# EAGLE design E-Book Wing Rev B (EAGLE 9.4.2)
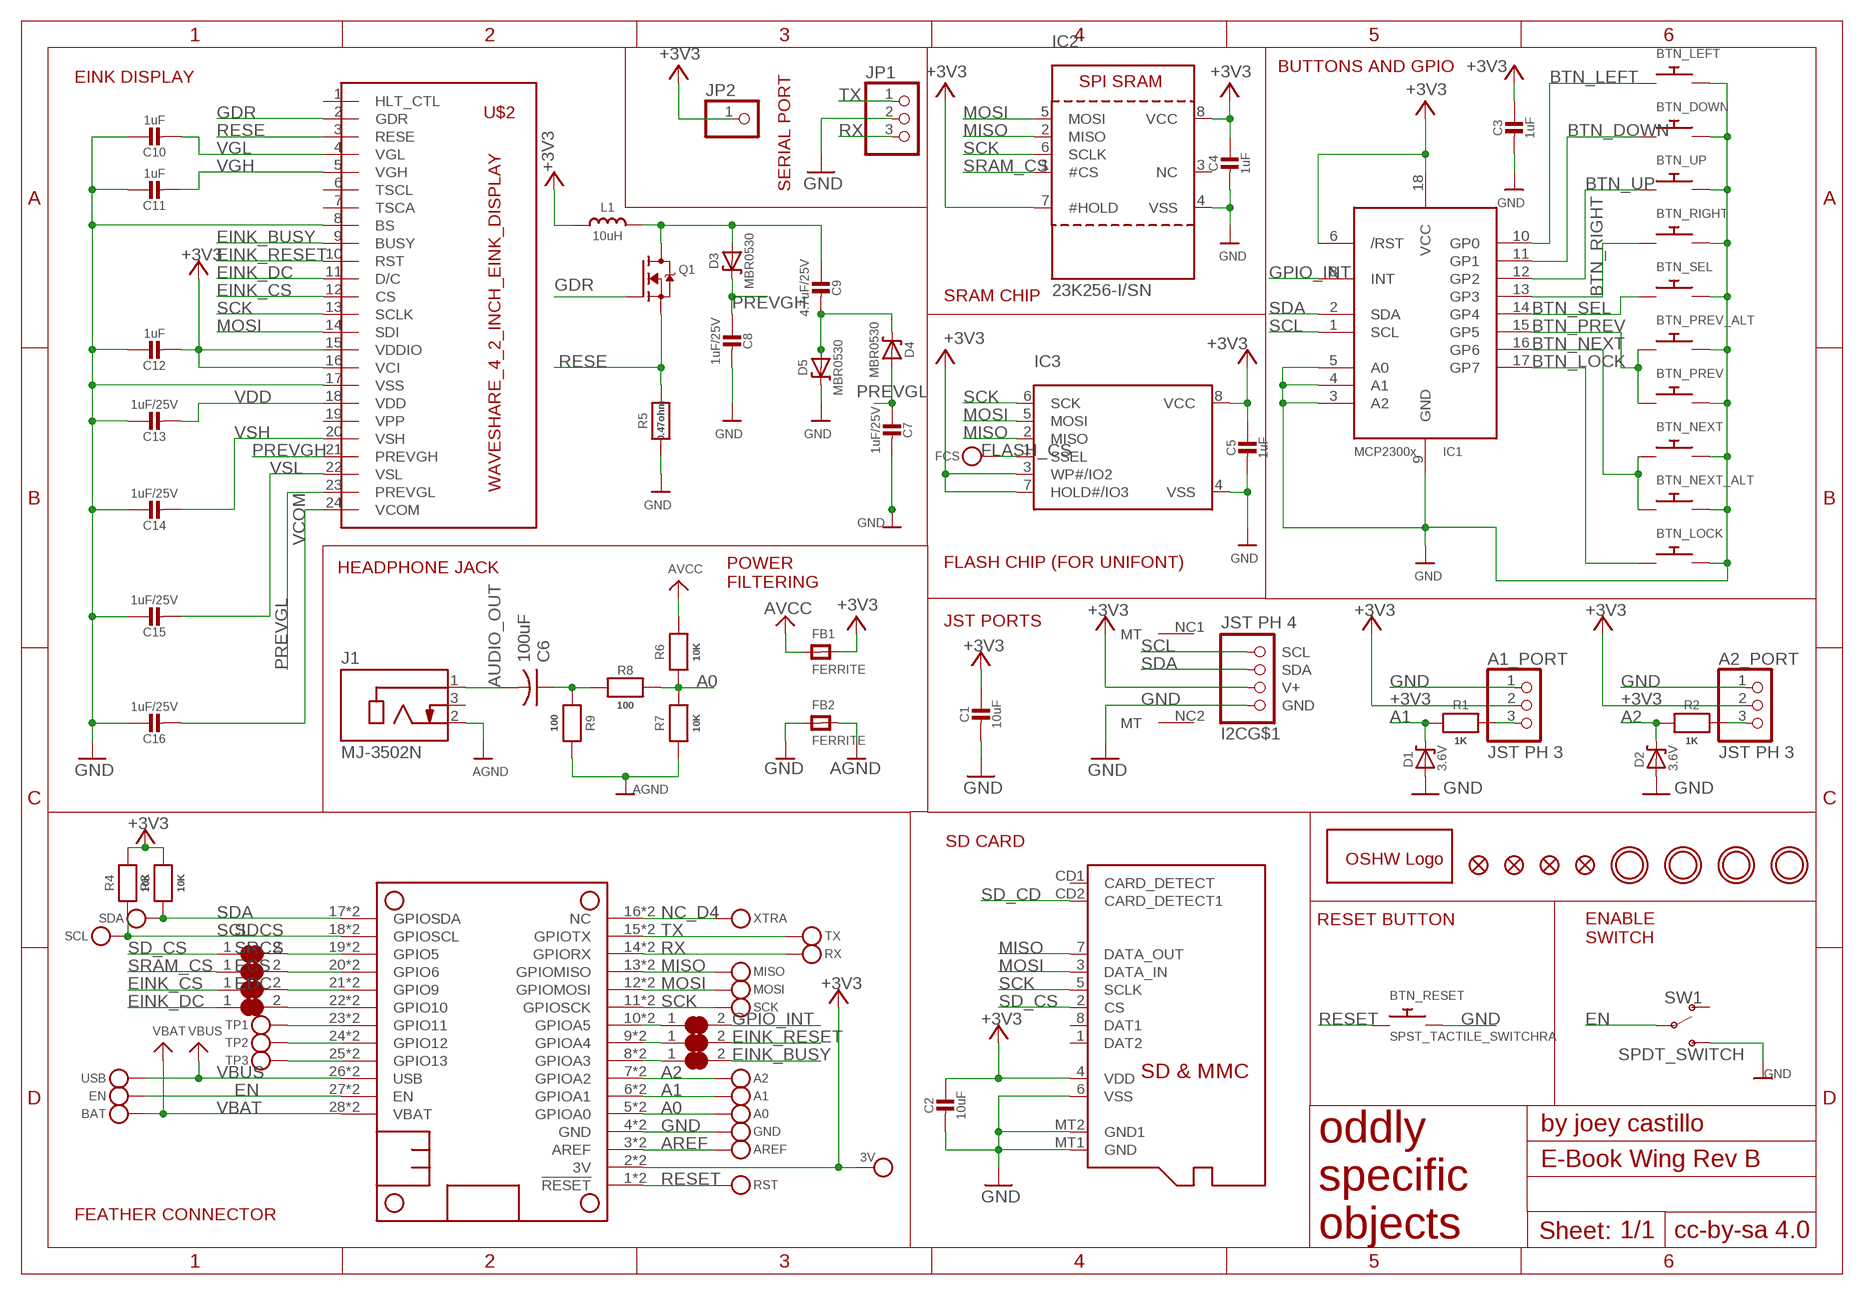
[diagram p0: schematic, sheet 1]

## Parts
3V  MICROBUILDER_TESTPOINT1.5X2.0MM_NOCREAM  [MICROBUILDER_PAD-1.5X2.0]
A0  MICROBUILDER_TESTPOINT1.5X2.0MM_NOCREAM  [MICROBUILDER_PAD-1.5X2.0]
A1  MICROBUILDER_TESTPOINT1.5X2.0MM_NOCREAM  [MICROBUILDER_PAD-1.5X2.0]
A1_PORT  JST PH 3  CON_JST_PH_3PIN  [JSTPH3]
A2  MICROBUILDER_TESTPOINT1.5X2.0MM_NOCREAM  [MICROBUILDER_PAD-1.5X2.0]
A2_PORT  JST PH 3  CON_JST_PH_3PIN  [JSTPH3]
AREF  MICROBUILDER_TESTPOINT1.5X2.0MM_NOCREAM  [MICROBUILDER_PAD-1.5X2.0]
BAT  MICROBUILDER_TESTPOINT1.5X2.0MM_NOCREAM  [MICROBUILDER_PAD-1.5X2.0]
BTN_DOWN  MJTP1250_SPST_SWITCH  [MJTP1250]
BTN_LEFT  MJTP1250_SPST_SWITCH  [MJTP1250]
BTN_LOCK  SPST_TACTILE_SWITCHRA  [TL3330AF130QG]
BTN_NEXT  MJTP1250_SPST_SWITCH  [MJTP1250]
BTN_NEXT_ALT  SPST_TACTILE_SWITCHRA  [TL3330AF130QG]
BTN_PREV  MJTP1250_SPST_SWITCH  [MJTP1250]
BTN_PREV_ALT  SPST_TACTILE_SWITCHRA  [TL3330AF130QG]
BTN_RESET  SPST_TACTILE_SWITCHRA  [TL3330AF130QG]
BTN_RIGHT  MJTP1250_SPST_SWITCH  [MJTP1250]
BTN_SEL  MJTP1250_SPST_SWITCH  [MJTP1250]
BTN_UP  MJTP1250_SPST_SWITCH  [MJTP1250]
C1  10uF  CAP_CERAMIC0805-NOOUTLINE  [0805-NO]
C2  10uF  CAP_CERAMIC0805_10MGAP  [0805_10MGAP]
C3  1uF  CAP_CERAMIC0805_10MGAP  [0805_10MGAP]
C4  1uF  CAP_CERAMIC0805_10MGAP  [0805_10MGAP]
C5  1uF  CAP_CERAMIC0805_10MGAP  [0805_10MGAP]
C6  100uF  C-USC1210  [C1210]
C7  1uF/25V  CAP_CERAMIC0805-NOOUTLINE  [0805-NO]
C8  1uF/25V  CAP_CERAMIC0805-NOOUTLINE  [0805-NO]
C9  4.7uF/25V  CAP_CERAMIC0805-NOOUTLINE  [0805-NO]
C10  1uF  CAP_CERAMIC0805-NOOUTLINE  [0805-NO]
C11  1uF  CAP_CERAMIC0805-NOOUTLINE  [0805-NO]
C12  1uF  CAP_CERAMIC0805-NOOUTLINE  [0805-NO]
C13  1uF/25V  CAP_CERAMIC0805-NOOUTLINE  [0805-NO]
C14  1uF/25V  CAP_CERAMIC0805-NOOUTLINE  [0805-NO]
C15  1uF/25V  CAP_CERAMIC0805-NOOUTLINE  [0805-NO]
C16  1uF/25V  CAP_CERAMIC0805-NOOUTLINE  [0805-NO]
D1  3.6V  DIODE-ZENERSOD123  [SOD-123]
D2  3.6V  DIODE-ZENERSOD123  [SOD-123]
D3  MBR0530  DIODE-SCHOTTKYSOD-123  [SOD-123]
D4  MBR0530  DIODE-SCHOTTKYSOD-123  [SOD-123]
D5  MBR0530  DIODE-SCHOTTKYSOD-123  [SOD-123]
EBSY  MICROBUILDER_SOLDERJUMPER_CLOSED  [MICROBUILDER_SOLDERJUMPER_CLOSEDWIRE]
ECS  MICROBUILDER_SOLDERJUMPER_CLOSED  [MICROBUILDER_SOLDERJUMPER_CLOSEDWIRE]
EDC  MICROBUILDER_SOLDERJUMPER_CLOSED  [MICROBUILDER_SOLDERJUMPER_CLOSEDWIRE]
EN  MICROBUILDER_TESTPOINT1.5X2.0MM_NOCREAM  [MICROBUILDER_PAD-1.5X2.0]
ERST  MICROBUILDER_SOLDERJUMPER_CLOSED  [MICROBUILDER_SOLDERJUMPER_CLOSEDWIRE]
FB1  FERRITE  FERRITE0805  [0805]
FB2  FERRITE  FERRITE0805  [0805]
FCS  MICROBUILDER_TESTPOINTPAD1MM  [MICROBUILDER_TESTPOINT_PAD_1MM]
FID1  FIDUCIAL_1MM  [FIDUCIAL_1MM]
FID2  FIDUCIAL_1MM  [FIDUCIAL_1MM]
FID3  FIDUCIAL_1MM  [FIDUCIAL_1MM]
FID4  FIDUCIAL_1MM  [FIDUCIAL_1MM]
GND  MICROBUILDER_TESTPOINT1.5X2.0MM_NOCREAM  [MICROBUILDER_PAD-1.5X2.0]
GOLD_ORB_SM1  OSHWLOGOLOGO5MM  [OSHW_5MM]
I2C  JST PH 4  STEMMA_I2C_RASMT  [JSTPH4]
IC1  MCP23008/SO  [SO18W]
IC2  23K256-I/SN  SRAM_SPI_SOIC8  [SOIC8_150MIL]
IC3  MICROBUILDER_SPIFLASH_SOIC8  [MICROBUILDER_SOIC8_150MIL]
INT  MICROBUILDER_SOLDERJUMPER_CLOSED  [MICROBUILDER_SOLDERJUMPER_CLOSEDWIRE]
J1  MJ-3502N  [CUI_MJ-3502N]
JP1  PINHD-1X3  [1X03]
JP2  PINHD-1X1  [1X01]
L1  10uH  INDUCTORNR401  [INDUCTOR_4X4MM_NR401]
MICROSD  MICROSD  [MICROSD]
MISO  MICROBUILDER_TESTPOINT1.5X2.0MM_NOCREAM  [MICROBUILDER_PAD-1.5X2.0]
MOSI  MICROBUILDER_TESTPOINT1.5X2.0MM_NOCREAM  [MICROBUILDER_PAD-1.5X2.0]
MS1  MICROBUILDER_FEATHERWING_SMTDUAL  [MICROBUILDER_FEATHERWING_SMT2]
Q1  IRLML0100  IRLML2060TRPBF  [SOT23-3]
R1  1K  RESISTOR_0805MP  [_0805MP]
R2  1K  RESISTOR_0805MP  [_0805MP]
R3  10K  RESISTOR_0805MP  [_0805MP]
R4  10K  RESISTOR_0805MP  [_0805MP]
R5  0.47ohm  RESISTOR0805_10MGAP  [0805_10MGAP]
R6  10K  RESISTOR_0805MP  [_0805MP]
R7  10K  RESISTOR_0805MP  [_0805MP]
R8  100  RESISTOR_0805MP  [_0805MP]
R9  100  RESISTOR_0805MP  [_0805MP]
RST  MICROBUILDER_TESTPOINT1.5X2.0MM_NOCREAM  [MICROBUILDER_PAD-1.5X2.0]
RX  MICROBUILDER_TESTPOINT1.5X2.0MM_NOCREAM  [MICROBUILDER_PAD-1.5X2.0]
SCK  MICROBUILDER_TESTPOINT1.5X2.0MM_NOCREAM  [MICROBUILDER_PAD-1.5X2.0]
SCL  MICROBUILDER_TESTPOINT1.5X2.0MM_NOCREAM  [MICROBUILDER_PAD-1.5X2.0]
SDA  MICROBUILDER_TESTPOINT1.5X2.0MM_NOCREAM  [MICROBUILDER_PAD-1.5X2.0]
SDCS  MICROBUILDER_SOLDERJUMPER_CLOSED  [MICROBUILDER_SOLDERJUMPER_CLOSEDWIRE]
SRCS  MICROBUILDER_SOLDERJUMPER_CLOSED  [MICROBUILDER_SOLDERJUMPER_CLOSEDWIRE]
SW1  SPDT_SWITCH  [A10767]
TP1  MICROBUILDER_TESTPOINT1.5X2.0MM_NOCREAM  [MICROBUILDER_PAD-1.5X2.0]
TP2  MICROBUILDER_TESTPOINT1.5X2.0MM_NOCREAM  [MICROBUILDER_PAD-1.5X2.0]
TP3  MICROBUILDER_TESTPOINT1.5X2.0MM_NOCREAM  [MICROBUILDER_PAD-1.5X2.0]
TX  MICROBUILDER_TESTPOINT1.5X2.0MM_NOCREAM  [MICROBUILDER_PAD-1.5X2.0]
U$1  MOUNTINGHOLE2.5  [MOUNTINGHOLE_2.5_PLATED]
U$2  WAVESHARE_4_2_INCH_EINK_DISPLAY  [EINK_DISPLAY_4_2IN]
U$4  MOUNTINGHOLE2.5  [MOUNTINGHOLE_2.5_PLATED]
U$5  MOUNTINGHOLE2.5  [MOUNTINGHOLE_2.5_PLATED]
U$7  MOUNTINGHOLE2.5  [MOUNTINGHOLE_2.5_PLATED]
USB  MICROBUILDER_TESTPOINT1.5X2.0MM_NOCREAM  [MICROBUILDER_PAD-1.5X2.0]
XTRA  MICROBUILDER_TESTPOINT1.5X2.0MM_NOCREAM  [MICROBUILDER_PAD-1.5X2.0]

## Nets
+3V3: 3V.P$1 A1_PORT.2 A2_PORT.2 C1.1 C2.1 C3.1 C4.1 C5.1 C12.2 FB1.2 I2C.2(V+) IC1.6(/RST) IC1.18(VCC) IC2.7(#HOLD) IC2.8(VCC) IC3.3(WP#/IO2) IC3.7(HOLD#/IO3) IC3.8(VCC) JP2.1 L1.P$2 MICROSD.4(VDD) MS1.2'(3V) MS1.2(3V) R3.1 R4.1 U$2.15(VDDIO) U$2.16(VCI)
_EINK_BUSY: EBSY.1 MS1.8'(GPIOA3) MS1.8(GPIOA3)
_EINK_CS: ECS.2 MS1.21'(GPIO9) MS1.21(GPIO9)
_EINK_DC: EDC.2 MS1.22'(GPIO10) MS1.22(GPIO10)
_EINK_RESET: ERST.1 MS1.9'(GPIOA4) MS1.9(GPIOA4)
_GPIO_INT: INT.1 MS1.10'(GPIOA5) MS1.10(GPIOA5)
_SD_CS: MS1.19'(GPIO5) MS1.19(GPIO5) SDCS.2
_SRAM_CS: MS1.20'(GPIO6) MS1.20(GPIO6) SRCS.2
A0: A0.P$1 MS1.5'(GPIOA0) MS1.5(GPIOA0) R6.2 R7.1 R8.1
A1: A1.P$1 D1.C MS1.6'(GPIOA1) MS1.6(GPIOA1) R1.2
A1_: A1_PORT.3 R1.1
A2: A2.P$1 D2.C MS1.7'(GPIOA2) MS1.7(GPIOA2) R2.2
A2_: A2_PORT.3 R2.1
AGND: FB2.2 J1.2 R7.2 R9.1
AREF: AREF.P$1 MS1.3'(AREF) MS1.3(AREF)
AUDIO_OUT: C6.2 J1.1
AVCC: FB1.1 R6.1
BTN_DOWN: BTN_DOWN.P$1 IC1.11(GP1)
BTN_LEFT: BTN_LEFT.P$1 IC1.10(GP0)
BTN_LOCK: BTN_LOCK.P$1 IC1.17(GP7)
BTN_NEXT: BTN_NEXT.P$1 BTN_NEXT_ALT.P$1 IC1.16(GP6)
BTN_PREV: BTN_PREV.P$1 BTN_PREV_ALT.P$1 IC1.15(GP5)
BTN_RIGHT: BTN_RIGHT.P$1 IC1.13(GP3)
BTN_SEL: BTN_SEL.P$1 IC1.14(GP4)
BTN_UP: BTN_UP.P$1 IC1.12(GP2)
EINK_BUSY: EBSY.2 U$2.9(BUSY)
EINK_CS: ECS.1 U$2.12(CS)
EINK_DC: EDC.1 U$2.11(D/C)
EINK_RESET: ERST.2 U$2.10(RST)
EN: EN.P$1 MS1.27'(EN) MS1.27(EN) SW1.P$2(P)
FLASH_CS: FCS.P$1 IC3.1(SSEL)
GDR: Q1.1(G) U$2.2(GDR)
GND: A1_PORT.1 A2_PORT.1 BTN_DOWN.P$2 BTN_LEFT.P$2 BTN_LOCK.P$2 BTN_NEXT.P$2 BTN_NEXT_ALT.P$2 BTN_PREV.P$2 BTN_PREV_ALT.P$2 BTN_RESET.P$2 BTN_RIGHT.P$2 BTN_SEL.P$2 BTN_UP.P$2 C1.2 C2.2 C3.2 C4.2 C5.2 C7.2 C8.2 C10.1 C11.1 C12.1 C13.1 C14.1 C15.1 C16.1 D1.A D2.A D5.C FB2.1 GND.P$1 I2C.1(GND) IC1.3(A2) IC1.4(A1) IC1.5(A0) IC1.9(GND) IC2.4(VSS) IC3.4(VSS) JP1.2 MICROSD.6(VSS) MICROSD.MT1(GND) MICROSD.MT2(GND1) MS1.4'(GND) MS1.4(GND) R5.2 SW1.P$3(S) U$2.8(BS) U$2.17(VSS)
GPIO_INT: IC1.8(INT) INT.2
MISO: IC2.2(MISO) IC3.2(MISO) MICROSD.7(DATA_OUT) MISO.P$1 MS1.13'(GPIOMISO) MS1.13(GPIOMISO)
MOSI: IC2.5(MOSI) IC3.5(MOSI) MICROSD.3(DATA_IN) MOSI.P$1 MS1.12'(GPIOMOSI) MS1.12(GPIOMOSI) U$2.14(SDI)
N$1: C6.1 R8.2 R9.2
N$2: C9.2 D4.C D5.A
N$3: C9.1 D3.A L1.P$1 Q1.3(D)
N$4: MS1.25'(GPIO13) MS1.25(GPIO13) TP3.P$1
N$5: MS1.24'(GPIO12) MS1.24(GPIO12) TP2.P$1
N$6: MS1.23'(GPIO11) MS1.23(GPIO11) TP1.P$1
NC_D4: MS1.16'(NC) MS1.16(NC) XTRA.P$1
PREVGH: C8.1 D3.C U$2.21(PREVGH)
PREVGL: C7.1 D4.A U$2.23(PREVGL)
RESE: Q1.2(S) R5.1 U$2.3(RESE)
RESET: BTN_RESET.P$1 MS1.1'(!RESET) MS1.1(!RESET) RST.P$1
RX: JP1.3 MS1.14'(GPIORX) MS1.14(GPIORX) RX.P$1
SCK: IC2.6(SCLK) IC3.6(SCK) MICROSD.5(SCLK) MS1.11'(GPIOSCK) MS1.11(GPIOSCK) SCK.P$1 U$2.13(SCLK)
SCL: I2C.4(SCL) IC1.1(SCL) MS1.18'(GPIOSCL) MS1.18(GPIOSCL) R4.2 SCL.P$1
SD_CD: MICROSD.CD2(CARD_DETECT1)
SD_CS: MICROSD.2(CS) SDCS.1
SDA: I2C.3(SDA) IC1.2(SDA) MS1.17'(GPIOSDA) MS1.17(GPIOSDA) R3.2 SDA.P$1
SRAM_CS: IC2.1(#CS) SRCS.1
TX: JP1.1 MS1.15'(GPIOTX) MS1.15(GPIOTX) TX.P$1
VBAT: BAT.P$1 MS1.28'(VBAT) MS1.28(VBAT)
VBUS: MS1.26'(USB) MS1.26(USB) USB.P$1
VCOM: C16.2 U$2.24(VCOM)
VDD: C13.2 U$2.18(VDD)
VGH: C11.2 U$2.5(VGH)
VGL: C10.2 U$2.4(VGL)
VSH: C14.2 U$2.20(VSH)
VSL: C15.2 U$2.22(VSL)
Unconnected: I2C.NC1(MT) I2C.NC2(MT) IC2.3(NC) J1.3 MICROSD.1(DAT2) MICROSD.8(DAT1) MICROSD.CD1(CARD_DETECT) SW1.P$1(O) U$2.1(HLT_CTL) U$2.6(TSCL) U$2.7(TSCA) U$2.19(VPP)

## Notes on the sheet
- BUTTONS AND GPIO
- EINK DISPLAY
- SERIAL PORT
- SRAM CHIP
- FLASH CHIP (FOR UNIFONT)
- HEADPHONE JACK
- POWER
  FILTERING
- JST PORTS
- SD CARD
- RESET BUTTON
- ENABLE
  SWITCH
- FEATHER CONNECTOR

## Library data of the parts
3V A0 A1 A2 AREF BAT EN FCS GND MISO MOSI RST RX SCK SCL SDA TP1-TP3 TX USB XTRA = Adafruit 3.5in 480x320 FeatherWing:MICROBUILDER_TESTPOINT: Test Point Various test points for characterisation and PCB testing TESTPOINT_SMT - Compact Surface Mount Test Point [Digikey: 5016KTR-ND]
A1_PORT A2_PORT = microbuilder:CON_JST_PH_3PIN
BTN_DOWN BTN_LEFT BTN_NEXT BTN_PREV BTN_RIGHT BTN_SEL BTN_UP = My Stuff:MJTP1250_SPST_SWITCH
BTN_LOCK BTN_NEXT_ALT BTN_PREV_ALT BTN_RESET = My Stuff:SPST_TACTILE_SWITCH
C1-C5 C7-C16 = microbuilder:CAP_CERAMIC: Ceramic Capacitors For new designs, use the packages preceded by an '_' character since they are more reliable: The following footprints should be used on most boards: _0402 - Standard footprint for regular board layouts _0603 - Standard footprint for regular board layouts _0805 - Standard footprint for regular board layouts _1206 - Standard footprint for regular board layouts For extremely tight-pitch boards where space is at a premium, the following 'micro-pitch' footprints can be used (smaller pads, no silkscreen outline, etc.): _0402MP - Micro-pitch footprint for very dense/compact boards _0603MP - Micro-pitch footprint for very dense/compact boards _0805MP - Micro-pitch footprint for very dense/compact boards _1206MP - Micro-pitch footprint for very dense/compact boards
C6 = resistor:C-US: CAPACITOR, American symbol
D1 D2 = microbuilder:DIODE-ZENER: Zener Diode SMA: 30V 1W Zener Diode, 1.2Vf - Digikey: SMAZ30-FDICT-ND
D3-D5 = microbuilder:DIODE-SCHOTTKY
EBSY ECS EDC ERST INT SDCS SRCS = Adafruit 3.5in 480x320 FeatherWing:MICROBUILDER_SOLDERJUMPER_CLOSED: Solder Jumper - Closed These solder jumpers are closed by default CLOSEDWIRE - 10 mil trace between pads that can be cut and resoldered later CLOSEDPERM - 63 mil trace between pads for a permanent connection (used to 'bridge' two signals, a shameless hack for Eagle). Can double as a test point as well (no cream layer)
FB1 FB2 = microbuilder:FERRITE: Ferrite Bead 0603 MMZ1608B121C - 120 Ohm @ 100MHz, 600mA, 0.15 Ohm DC Resistance - Digikey: 445-2164-1-ND BK1608HW121-T - 120 Ohm, 600mA Ferrite Chip - Digikey: 587-1876-2-ND 0805 HZ0805B272R-10 - 2.7K Ohm @ 100MHz, 200mA, 0.8 Ohm DC Resistance - Digikey: 240-2504-1-ND (see also Murata BLM21BD272SN1L) MMZ2012Y152B - 1.5K Ohm @ 100MHz, 500mA, 0.4 Ohm DC Resistance - Digikey: 445-1560-1-ND - Mainly for high frequency (80-400MHz) MMZ2012R102A - 1K Ohm @ 100MHz, 500mA, 0.3 Ohm DC Resistance - Digikey: 445-1555-2-ND - More general purpose (10-200MHz)
FID1-FID4 = microbuilder:FIDUCIAL: Fiducial Alignment Points Various fiducial points for machine vision alignment.; BOM: EXCLUDE
GOLD_ORB_SM1 = oshw:OSHWLOGO: The OSHW logo for PCB layout
I2C = microbuilder:STEMMA_I2C
IC1 = My Stuff:MCP23008: MCP23008 Inexpensive i2c i/o expander - 8 general purpose i/o pins with optional pullups
IC2 = microbuilder:SRAM_SPI_SOIC8: SRAM - 8-Pin SPI Interface 23K640-I/SN - 8KB (64Kb), 20MHz, 2.7-3.6V 23K256-I/SN - 32KB (256Kb), 20MHz, 2.7-3.6V 23LC512-I/SN - 64KB (512Kb), 20MHz, 2.7-3.6V
IC3 = Adafruit Feather M0 Express:MICROBUILDER_SPIFLASH_SOIC8: SOIC8 SPI Flash Be careful with the size since SOIC8 flash comes in several 'widths' SOIC8 150 mil M25P16 - 16Mbit (2Mbit x 8) Serial Flash (75MHz SPI Bus), Supply: 2.7-3.6V Digikey: SOIC8 - M25P16-VMN6P-ND SOIC8 208 mil W25Q16BVSSIG - 16Mbit (2Mbit x 8) Serial Flash (104MHz SPI Bus), Supply: 2.7-3.6V Digikey: SOIC8 - W25Q16BVSSIG-ND
J1 = MJ-3502N:MJ-3502N: 3.5 mm, Mono, Right Angle, Through Hole, Audio Jack Connector; CUI_PURCHASE_URL: https://www.cui.com/product/interconnect/connectors/audio-connectors/jacks/mj-3502n?utm_source=snapeda.com&utm_medium=referral&utm_campaign=snapedaBOM; DESCRIPTION: 3.5 mm, Mono, Right Angle, Through Hole, Audio Jack Connector; DIGI-KEY_PART_NUMBER: CP-3502N-ND; DIGI-KEY_PURCHASE_URL: https://www.digikey.com/product-detail/en/cui-inc/MJ-3502N/CP-3502N-ND/281266?utm_source=snapeda&utm_medium=aggregator&utm_campaign=symbol; MF: CUI Inc.; MP: MJ-3502N; PACKAGE: None
JP1 = adafruit:PINHD-1X3: PIN HEADER
JP2 = adafruit:PINHD-1X1: Pin header 1x1 for 0.1" spacing With round pins
L1 = microbuilder:INDUCTOR: Inductors 0603: 10nH Ceramic Inductor - microwire antenna/RF (Digikey: 712-1434-2-ND) 0805: 560nH Ceramic Inductor - RF (Digikey: 553-1047-1-ND) 270nH Ceramic Inductor - Q = 40@250MHz, +-5%, 1 Ohm DC Resistance (Digikey: 535-10506-2-ND) 1007 (2518 Metric) SMT: 10µH 10% 250mOhm 820mA 1007 Inductor (Digikey: 587-2189-1-ND) 22µH 10% 500mOhm 580mA 1007 Inductor (Digikey: 587-2190-1-ND) 47µH 10% 950mOhm 420mA 1007 Inductor (Digikey: 587-2191-1-ND) 47µH 5% 100mOhm 1A 1008 Inductor (Digikey: 732-1816-1-ND) 5.0x5.0mm (Taiyo Yuden NR5040 Series) 6.8µH 20% 2.3A 64mOhm Inductor (Digikey: 587-2374-2-ND) 5.0x5.0mm (TDK VLC5045 Series) 4.7µH 20% 3.3A 34mOhm Inductor (Digikey: 445-6526-1-ND) 6.8µH 20% 2.7A 46mOhm Inductor (Digikey: 445-6527-1-ND) 6.0x6.0mm (TDK VLC6045 Series) 4.7µH 20% 3.8A 27mOhm Inductor (Digikey: 445-6538-2-ND) 6.8µH 20% 3A 41mOhm Inductor (Digikey: 445-6540-1-ND) 6.2µH 30% 2.2A 45mOhm Inductor (Digikey: SRR5028-6R2YCT-ND) - Not TDK VLC6045 but footprint should match 6.0x6.0mm (TDK SLF6045 Series) 6.8uH 30% 2A 33mOhm Inductor (Digikey: 445-4572-1-ND, Mouser: 810-SLF645T6R8N2R0PF) 6.0x6.0mm (Sumida CDRH5D28 Series) 6.2uH 30% 1.8A 45mOhm Inductor (Digikey: 308-1542-1-ND) Taiyo Yuden NR3015T2R2M - 2.2uH 20% 1.5A (Digikey: 587-1648-2-ND, Mouser: 963-NR3015T2R2M) - Used with TI TPS62172 CoilCraft RFID Transponder Coil - MA5532-AE (For use with AS3935 Lightning Sensor) Taiyo Yuden NRH2412T2R2MNGH - 2.2uH 20% 1AA (Digikey: 587-3443-1-ND) - Used with TI LM3671 Vishay IHLP 1.0uH Molded Inductor - 24mOhm DCR, 5A, +/-20%, -55°C-125°C (Digikey: 541-1319-1-ND)
MICROSD = adafruit:MICROSD: Micro-SD / Transflash card holder with SPI pinout For the 3M # 2908-05WB-MG and/or 4UCON #19656 push-push type
MS1 = My Stuff:MICROBUILDER_FEATHERWING
Q1 = Parts:IRLML2060TRPBF
R1-R9 = microbuilder:RESISTOR: Resistors For new designs, use the packages preceded by an '_' character since they are more reliable: The following footprints should be used on most boards: _0402 - Standard footprint for regular board layouts _0603 - Standard footprint for regular board layouts _0805 - Standard footprint for regular board layouts _1206 - Standard footprint for regular board layouts For extremely tight-pitch boards where space is at a premium, the following 'micro-pitch' footprints can be used (smaller pads, no silkscreen outline, etc.): _0402MP - Micro-pitch footprint for very dense/compact boards _0603MP - Micro-pitch footprint for very dense/compact boards _0805MP - Micro-pitch footprint for very dense/compact boards _1206MP - Micro-pitch footprint for very dense/compact boards
SW1 = My Stuff:SPDT_SWITCH
U$1 U$4 U$5 U$7 = microbuilder:MOUNTINGHOLE: Mounting Hole For #2 screws (0.086"/2.18mm width, 0.094"/2.4mm hole) use 2.5mm; BOM: EXCLUDE
U$2 = My Stuff:WAVESHARE_4_2_INCH_EINK_DISPLAY

## Net classes
1 power: width 0.305 mm

## Board
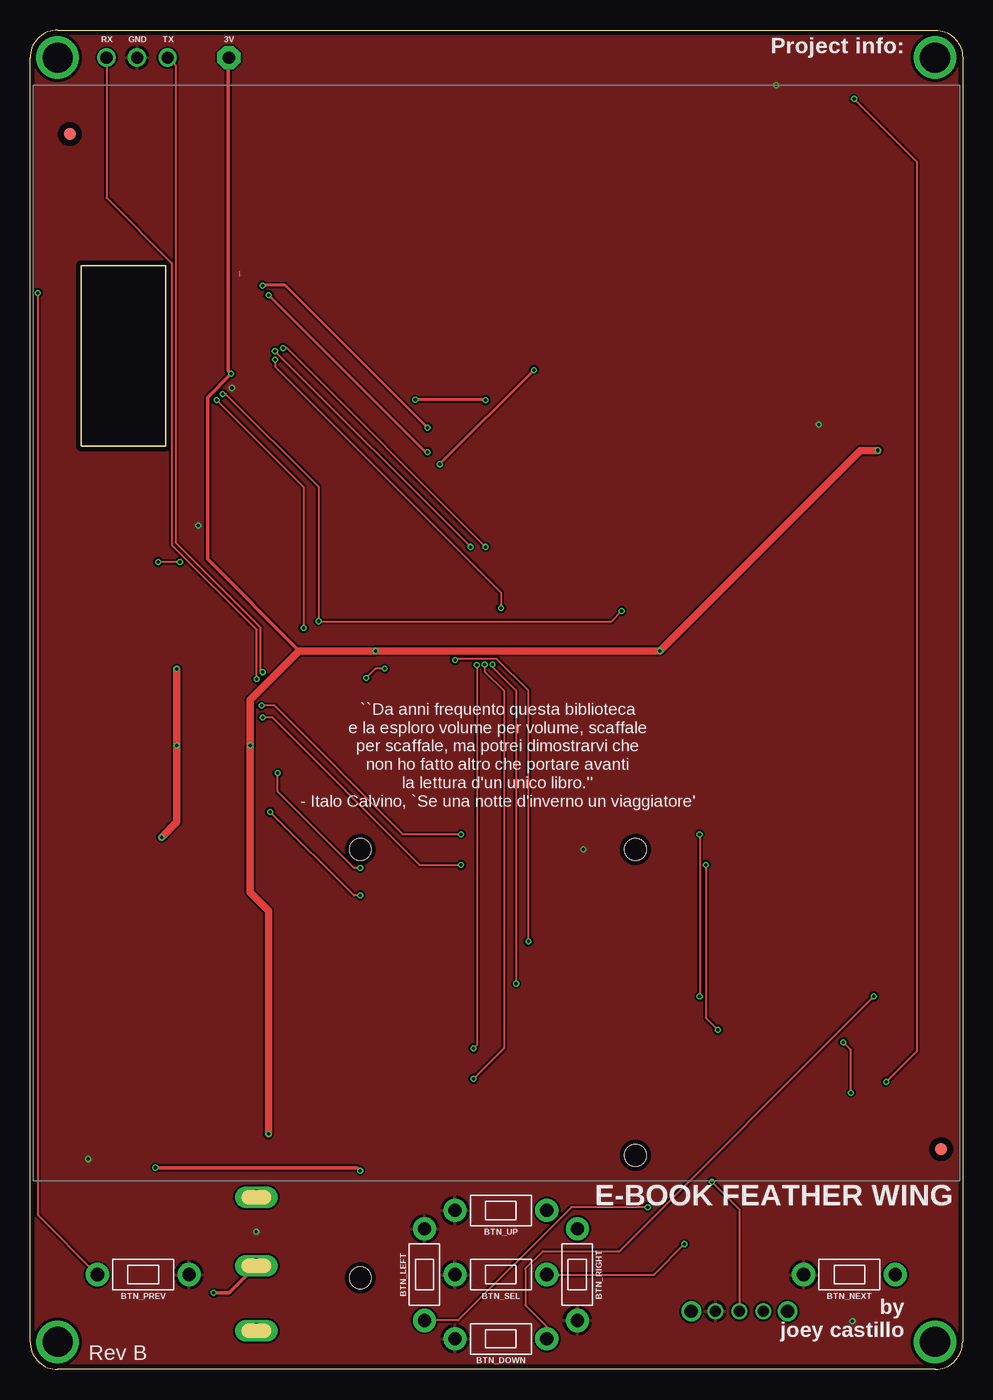
[diagram p1: board, top side]
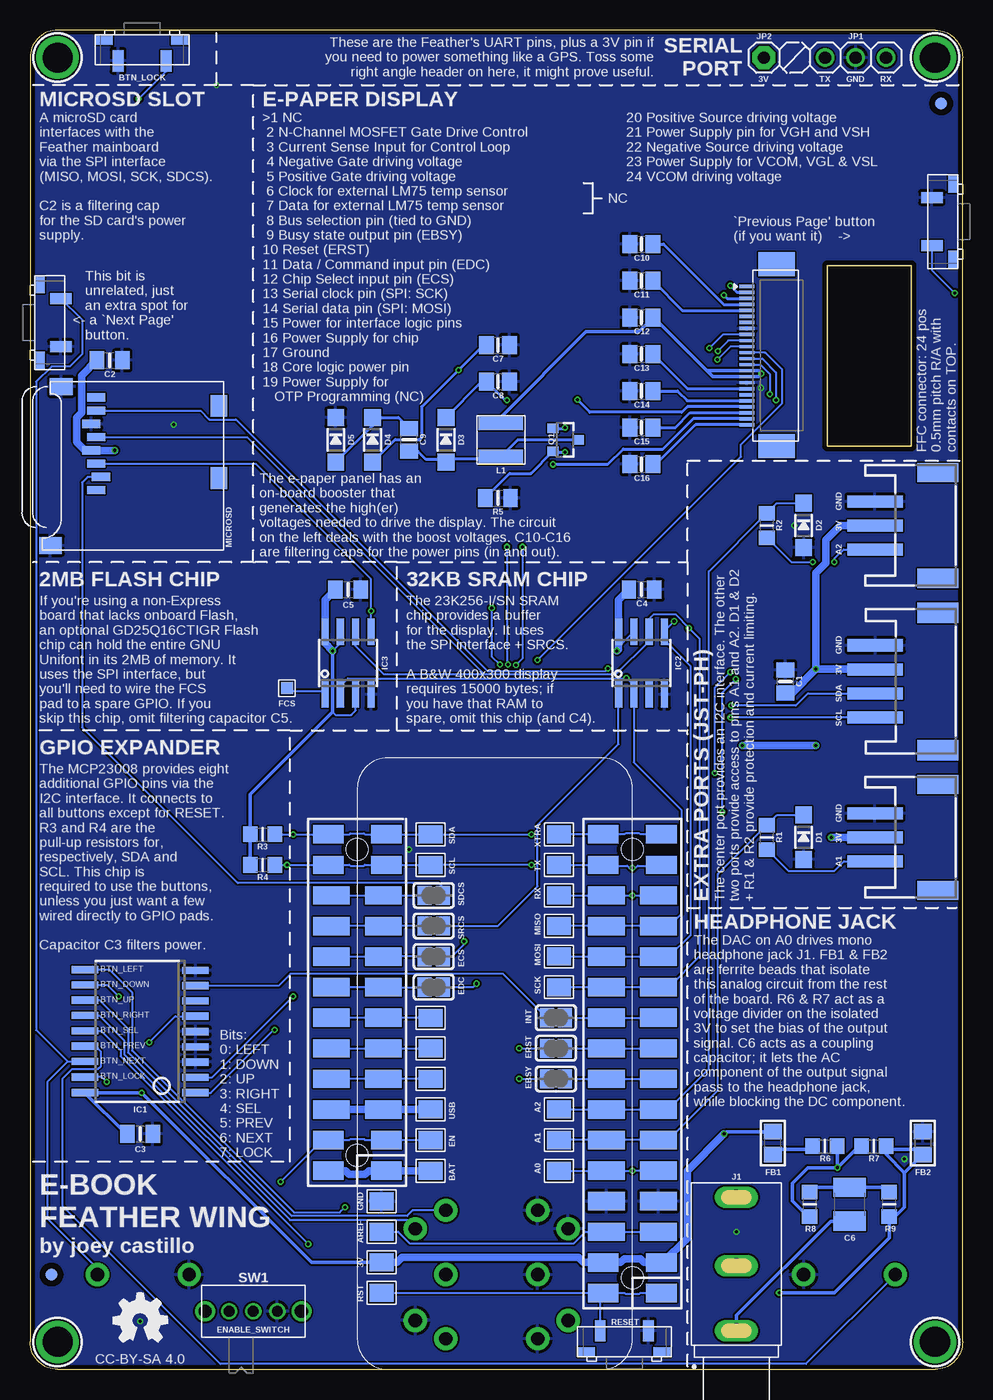
[diagram p2: board, bottom side, seen from below]

Size 77.47 x 111.25 mm. Coordinates in mm from the lower left corner, seen from the top.
Outline: 2.29,111.25 75.18,111.25 arc-90 77.47,108.97 77.47,2.29 arc-90 75.18,0 2.29,0 arc-90 0,2.29 0,108.97 arc-90 2.29,111.25
Copper layers (1*16): Top 0.035559375mm / dielectric 1.6mm / Bottom 0.035559375mm
Design rules "oshpark-2layer *": minimum track width 6mil, minimum drill 10mil, track to track 6mil, track to pad 6mil, pad to pad 6mil, via to via 6mil, smd to smd 6mil, copper to edge 15mil, drill to drill 6mil, minimum pad ring 5mil, minimum via ring 5mil, stop-mask expansion 2.5mil, vias tented up to drill 10mil, thermal gap 10mil

### Footprints (pad centres in the part's own frame; a part is rotated, then mirrored left to right if it is on the bottom)
MICROBUILDER_PAD-1.5X2.0 = smd 1.5 x 2: P$1 0,0
JSTPH3 = smd 1 x 4.6: 1 -2,-2.7; 2 0,-2.7; 3 2,-2.7 | smd 1.6 x 3.4: NC1 -4.4,2.5; NC2 4.4,2.5
MJTP1250 = drill 1.1 pad 1.93: P$1 -2.54,0; P$2 5.08,0
TL3330AF130QG = smd 1.45 x 0.8: MP1 0.75,-2.1; MP2 7.05,-2.1 | smd 0.9 x 1.778: P$1 1.9,-0.346; P$2 5.9,-0.346
0805-NO = smd 1.24 x 1.5: 1 -0.95,0; 2 0.95,0
0805_10MGAP = smd 1.2 x 1.5: 1 -1.05,0; 2 1.05,0
C1210 = smd 1.6 x 2.7: 1 -1.4,0; 2 1.4,0
SOD-123 = smd 1.4 x 1.4: A 1.85,0; C -1.85,0
MICROBUILDER_SOLDERJUMPER_CLOSEDWIRE = smd 1.168 x 1.6: 1 -0.762,0; 2 0.762,0 | smd 0.635 x 0.203: WIRE 0,0
0805 = smd 1.3 x 1.5: 1 -0.95,0; 2 0.95,0
MICROBUILDER_TESTPOINT_PAD_1MM = smd 1 x 1: P$1 0,0
FIDUCIAL_1MM = smd 1 x 1: 1 0,0
JSTPH4 = smd 1 x 4.6: 1 -3,-3.7; 2 -1,-3.7; 3 1,-3.7; 4 3,-3.7 | smd 1.7 x 3.4: NC1 -5.7,1.5; NC2 5.7,1.5
SO18W = smd 0.6 x 2.2: 1 -4.445,-4.6; 2 -3.175,-4.6; 3 -1.905,-4.6; 4 -0.635,-4.6; 5 0.635,-4.6; 6 1.905,-4.6; 7 3.175,-4.6; 8 4.445,-4.6; 9 5.715,-4.6; 10 5.775,4.6; 11 4.505,4.6; 12 3.235,4.6; 13 1.965,4.6; 14 0.695,4.6; 15 -0.575,4.6; 16 -1.845,4.6; 17 -3.145,4.6; 18 -4.445,4.6
SOIC8_150MIL = smd 0.6 x 2.2: 1 -1.905,-2.6; 2 -0.635,-2.6; 3 0.635,-2.6; 4 1.905,-2.6; 5 1.905,2.6; 6 0.635,2.6; 7 -0.635,2.6; 8 -1.905,2.6
MICROBUILDER_SOIC8_150MIL = smd 0.6 x 2.2: 1 -1.905,-2.6; 2 -0.635,-2.6; 3 0.635,-2.6; 4 1.905,-2.6; 5 1.905,2.6; 6 0.635,2.6; 7 -0.635,2.6; 8 -1.905,2.6
CUI_MJ-3502N = drill 1.2 long: 1 -5.55,0; 2 -0.15,0; 3 5.55,0
1X03 = drill 1.016: 1 -2.54,0; 2 0,0; 3 2.54,0
1X01 = drill 1.016 pad 1.93 octagon: 1 0,0
INDUCTOR_4X4MM_NR401 = smd 1.2 x 3.7: P$1 -1.4,0; P$2 1.4,0
MICROSD = smd 0.7 x 1.5: 1 9,-10.64; 2 7.9,-10.24; 3 6.8,-10.64; 4 5.7,-11.04; 5 4.6,-10.64; 6 3.5,-11.04; 7 2.4,-10.64; 8 1.3,-10.64 | smd 1.8 x 1.4: CD1 2,-0.44; CD2 8,-0.44 | smd 1.4 x 1.9: MT1 0.4,-13.54; MT2 13.6,-14.44
MICROBUILDER_FEATHERWING_SMT2 = smd 1.524 x 2.54: 1 6.35,2.413; 1' 6.35,-2.413; 2 8.89,2.413; 2' 8.89,-2.413; 15 41.91,2.413; 15' 41.91,-2.413; 16 44.45,2.413; 16' 44.45,-2.413; 17 44.45,20.447; 17' 44.45,25.273; 18 41.91,20.447; 18' 41.91,25.273; 27 19.05,20.447; 27' 19.05,25.273; 28 16.51,20.447; 28' 16.51,25.273 | smd 1.524 x 3.048: 3 11.43,2.159; 3' 11.43,-2.159; 4 13.97,2.159; 4' 13.97,-2.159; 5 16.51,2.159; 5' 16.51,-2.159; 6 19.05,2.159; 6' 19.05,-2.159; 7 21.59,2.159; 7' 21.59,-2.159; 8 24.13,2.159; 8' 24.13,-2.159; 9 26.67,2.159; 9' 26.67,-2.159; 10 29.21,2.159; 10' 29.21,-2.159; 11 31.75,2.159; 11' 31.75,-2.159; 12 34.29,2.159; 12' 34.29,-2.159; 13 36.83,2.159; 13' 36.83,-2.159; 14 39.37,2.159; 14' 39.37,-2.159; 19 39.37,20.701; 19' 39.37,25.019; 20 36.83,20.701; 20' 36.83,25.019; 21 34.29,20.701; 21' 34.29,25.019; 22 31.75,20.701; 22' 31.75,25.019; 23 29.21,20.701; 23' 29.21,25.019; 24 26.67,20.701; 24' 26.67,25.019; 25 24.13,20.701; 25' 24.13,25.019; 26 21.59,20.701; 26' 21.59,25.019 | hole 1.8: 17.78,22.86; 43.18,22.86; 7.62,0; 43.18,0
SOT23-3 = smd 0.8 x 0.9: 1 -0.95,-1; 2 0.95,-1; 3 0,1.1
_0805MP = smd 1.2 x 1.3: 1 -1.016,0; 2 1.016,0
A10767 = drill 1.1: MP1 -4,0; MP2 4,0 | drill 0.9: P$1 -2,0; P$2 0,0; P$3 2,0
MOUNTINGHOLE_2.5_PLATED = drill 2.5 pad 3.2: P$1 0,0
EINK_DISPLAY_4_2IN = smd 1.25 x 0.275 bottom: 1 17.653,-16.717; 2 17.653,-17.217; 3 17.653,-17.717; 4 17.653,-18.217; 5 17.653,-18.717; 6 17.653,-19.217; 7 17.653,-19.717; 8 17.653,-20.217; 9 17.653,-20.717; 10 17.653,-21.217; 11 17.653,-21.717; 12 17.653,-22.217; 13 17.653,-22.717; 14 17.653,-23.217; 15 17.653,-23.717; 16 17.653,-24.217; 17 17.653,-24.717; 18 17.653,-25.217; 19 17.653,-25.717; 20 17.653,-26.217; 21 17.653,-26.717; 22 17.653,-27.217; 23 17.653,-27.717; 24 17.653,-28.217 | smd 3 x 2 bottom: SPRT1 15.193,-14.867; SPRT2 15.193,-29.977

### Placement (x,y rotation side)
3V  48.26,8.89 270 bottom
A0  33.53,16.51 270 bottom
A1  33.53,19.05 270 bottom
A1_PORT  4.57,44.2 270 bottom
A2  33.53,21.59 270 bottom
A2_PORT  4.57,70.1 270 bottom
AREF  48.26,11.43 90 bottom
BAT  44.2,16.51 270 bottom
BTN_DOWN  40.39,2.54 180 top
BTN_LEFT  32.77,6.6 90 top
BTN_LOCK  64.26,108.36 180 bottom
BTN_NEXT  69.34,7.87 180 top
BTN_NEXT_ALT  74.57,90.86 270 bottom
BTN_PREV  8.13,7.87 0 top
BTN_PREV_ALT  2.9,91.44 90 bottom
BTN_RESET  32,3.56 0 bottom
BTN_RIGHT  45.47,9.14 270 top
BTN_SEL  40.39,7.87 180 top
BTN_UP  40.39,13.21 180 top
C1  14.73,57.15 90 bottom
C2  70.87,83.82 0 bottom
C3  68.33,19.56 0 bottom
C4  26.67,64.77 0 bottom
C5  51.05,64.77 0 bottom
C6  9.4,13.72 270 bottom
C7  38.61,85.09 0 bottom
C8  38.61,82.04 0 bottom
C9  45.97,77.22 90 bottom
C10  26.67,93.47 0 bottom
C11  26.67,90.42 0 bottom
C12  26.67,87.38 0 bottom
C13  26.67,84.33 0 bottom
C14  26.67,81.28 0 bottom
C15  26.67,78.23 0 bottom
C16  26.67,75.18 0 bottom
D1  13.21,44.2 270 bottom
D2  13.21,70.1 270 bottom
D3  42.93,77.22 270 bottom
D4  49.02,77.22 270 bottom
D5  52.07,77.22 270 bottom
EBSY  33.78,24.13 180 bottom
ECS  43.94,34.29 180 bottom
EDC  43.94,31.75 180 bottom
EN  44.2,19.05 270 bottom
ERST  33.78,26.67 180 bottom
FB1  15.75,18.8 90 bottom
FB2  3.3,18.8 270 bottom
FCS  56.13,56.59 180 bottom
FID1  75.69,7.87 0 bottom
FID2  75.69,18.29 0 top
FID3  1.78,105.16 0 bottom
FID4  3.3,102.62 0 top
GND  48.26,13.97 90 bottom
GOLD_ORB_SM1  68.33,4.06 0 bottom
I2C  3.56,57.15 270 bottom
IC1  68.33,27.43 90 bottom
IC2  26.67,58.67 0 bottom
IC3  51.05,58.67 0 bottom
INT  33.78,29.21 180 bottom
J1  18.8,8.76 90 bottom
JP1  8.89,108.97 0 bottom
JP2  16.51,108.97 0 bottom
L1  38.35,77.22 90 bottom
MICROSD  61.34,82.04 270 bottom
MISO  33.53,36.83 270 bottom
MOSI  33.53,34.29 270 bottom
MS1  27.43,0 90 bottom
Q1  33.02,77.22 270 bottom
R1  16.26,44.2 90 bottom
R2  16.26,70.1 90 bottom
R3  58.17,44.45 0 bottom
R4  58.17,41.91 0 bottom
R5  38.61,72.39 0 bottom
R6  11.43,18.54 0 bottom
R7  7.37,18.54 0 bottom
R8  12.7,13.72 90 bottom
R9  6.1,13.72 90 bottom
RST  48.26,6.35 90 bottom
RX  33.53,39.37 270 bottom
SCK  33.53,31.75 270 bottom
SCL  44.2,41.91 270 bottom
SDA  44.2,44.45 270 bottom
SDCS  43.94,39.37 180 bottom
SRCS  43.94,36.83 180 bottom
SW1  58.93,4.83 0 bottom
TP1  44.2,29.21 270 bottom
TP2  44.2,26.67 270 bottom
TP3  44.2,24.13 270 bottom
TX  33.53,41.91 270 bottom
U$1  2.29,2.29 0 bottom
U$2  0.25,106.68 0 top
U$4  75.18,2.29 0 bottom
U$5  2.29,108.97 0 bottom
U$7  75.18,108.97 0 bottom
USB  44.2,21.59 270 bottom
XTRA  33.53,44.45 270 bottom

### Tracks (layer width: path | path; a pad name or v marks a point on that pad's centre or on a via)
+3V3  (via drill 0.25)
  Top 0.152: v68.2,22.99 68.2,26.54 v67.56,27.18
  Top 0.305: 22.35,59.69 14.73,67.31 14.73,80.72 v16.71,82.7 16.46,82.96 16.46,108.76 16.51,108.81 JP2.1
  Top 0.61: v12.19,58.17 v12.19,51.82 12.19,45.47 v10.92,44.2 | v19.81,19.56 19.81,38.1 18.28,39.63 v18.29,51.82 18.29,53.21 18.27,55.61 22.35,59.69 v28.7,59.69 v52.32,59.69 68.98,76.34 v70.43,76.34
  Bottom 0.152: v52.32,59.69 51.69,60.33 IC3.7 | 52.32,54.61 52.07,54.36 50.8,54.36 50.42,54.74 IC3.3 | IC2.7 28.7,59.88 v28.7,59.69 | v67.56,27.18 65.41,29.34 IC1.6
  Bottom 0.279: 25.65,87.38 21.24,82.96 | 21.24,82.96 20.74,82.46 U$2.16 16.95,82.46 v16.71,82.7 16.97,82.96 U$2.15 21.24,82.96 | L1.P$2 38.35,79.12 31.28,86.2 26.9,86.2 C12.2
  Bottom 0.305: 3V.P$1 54.1,8.89 v68.2,22.99 IC1.18 69.5,19.56 C3.1 | v52.32,59.69 52.32,54.61 59.18,47.75 R3.1 R4.1 | 25.65,87.38 C12.2 | v19.81,19.56 19.62,19.75 FB1.2
  Bottom 0.61: v28.7,59.69 28.58,59.82 IC2.8 28.58,61.28 28.58,63.91 C4.1 | v52.32,59.69 52.96,60.33 IC3.8 52.97,61.28 52.97,63.91 C5.1 | 3V.P$1 46.97,8.89 46.56,9.3 31.92,9.3 31.52,8.89 MS1.2 28.41,8.89 28.09,9.21 26.78,9.21 26.46,8.89 MS1.2' 24.88,8.89 22.86,10.91 22.86,16.51 v19.81,19.56 | v12.19,58.17 12.19,66.16 11.35,66.99 11.35,68.91 10.16,70.1 A2_PORT.2 | v12.19,58.17 14.16,56.2 C1.1 | A1_PORT.2 v10.92,44.2 | v12.19,51.82 v18.29,51.82 | I2C.2 7.27,58.17 v12.19,58.17 | v70.43,76.34 MICROSD.4 72.42,76.38 72.92,76.38 73.59,77.05 73.59,79.08 73.19,79.48 73.19,82.55 C2.1
_EINK_BUSY
  Bottom 0.152: EBSY.1 MS1.8 MS1.8'
_EINK_CS
  Bottom 0.152: MS1.21' MS1.21 ECS.2
_EINK_DC
  Bottom 0.152: MS1.22' MS1.22 EDC.2
_EINK_RESET
  Bottom 0.152: ERST.1 MS1.9 MS1.9'
_GPIO_INT
  Bottom 0.152: INT.1 MS1.10 MS1.10'
_SD_CS
  Bottom 0.152: MS1.19' MS1.19 SDCS.2
_SRAM_CS
  Bottom 0.152: SRCS.2 MS1.20 MS1.20'
A0  (via drill 0.25)
  Top 0.305: v27.43,16.51 27.18,16.76 v10.41,16.76
  Bottom 0.152: A0.P$1 MS1.5 v27.43,16.51 MS1.5'
  Bottom 0.305: R8.1 12.86,12.7 14.16,14.01 14.16,15.46 12.86,16.76 v10.41,16.76 | R7.1 8.64,18.54 v10.41,16.76 | R6.2 v10.41,16.76
A1
  Bottom 0.152: A1.P$1 MS1.6 MS1.6' 24.44,19.05 20.32,23.17 20.32,41.15 R1.2 15.42,46.05 D1.C
A1_
  Bottom 0.152: A1_PORT.3 9.86,42.2 10.63,41.42 14.49,41.42 R1.1
A2
  Bottom 0.152: A2.P$1 MS1.7 MS1.7' 24.44,21.59 21.08,24.95 21.08,66.29 R2.2 15.42,71.95 D2.C
A2_  (via drill 0.25)
  Top 0.152: v12.45,67.06 v10.64,67.06
  Bottom 0.152: R2.1 14.22,67.06 v12.45,67.06 | v10.64,67.06 10.64,67.33 9.87,68.1 A2_PORT.3
AGND  (via drill 0.25)
  Top 0.305: J1.2 16.53,6.35 v15.24,6.35
  Bottom 0.305: v15.24,6.35 10.67,6.35 6.1,10.92 R9.1 5.59,12.7 4.83,13.46 4.83,16.32 | 4.83,16.32 FB2.2 3.74,18.29 6.1,18.29 R7.2 6.35,17.85 4.83,16.32
AREF
  Bottom 0.152: MS1.3' 29.46,11.43 MS1.3 31.33,11.43 32.27,10.49 45.96,10.49 46.9,11.43 AREF.P$1
AUDIO_OUT
  Bottom 0.305: C6.2 10.96,12.32 18.8,4.48 J1.1
AVCC
  Bottom 0.305: FB1.1 15.31,18.29 12.45,18.29 R6.1
BTN_DOWN  (via drill 0.25)
  Top 0.152: BTN_DOWN.P$1 42.93,3.56 41.15,5.33 41.15,8.38 42.6,9.83 48.95,9.83 v70.1,30.99
  Bottom 0.152: IC1.11 71.05,31.94 v70.1,30.99
BTN_LEFT  (via drill 0.25)
  Top 0.152: v51.31,13.47 44.97,13.47 35.56,4.06 BTN_LEFT.P$1
  Bottom 0.152: v51.31,13.47 51.74,13.04 55.55,13.04 69,26.49 69,31.33 70.88,33.21 IC1.10
BTN_LOCK  (via drill 0.25)
  Top 0.152: v68.45,105.54 73.66,100.33 73.66,26.42 v71.12,23.88
  Bottom 0.152: BTN_LOCK.P$1 66.16,107.83 v68.45,105.54 | v71.12,23.88 71.53,24.29 IC1.17
BTN_NEXT
  Bottom 0.152: 74.35,25.58 72.94,25.58 IC1.16 | 74.35,25.58 76.96,28.19 76.96,82.04 75.69,83.31 74.17,83.31 73.15,84.33 73.15,87.19 BTN_NEXT_ALT.P$1 | BTN_NEXT.P$1 71.88,8.38 76,12.5 76,23.93 74.35,25.58
BTN_PREV  (via drill 0.25)
  Top 0.152: v0.64,89.41 0.64,12.83 BTN_PREV.P$1
  Bottom 0.152: BTN_PREV_ALT.P$1 2.55,91.32 v0.64,89.41 | BTN_PREV.P$1 13,0.46 61.67,0.46 74.76,13.55 74.76,24.17 73.98,24.96 71.83,24.96 71.6,25.19 71.6,26.42 72.04,26.86 IC1.15
BTN_RIGHT
  Bottom 0.152: BTN_RIGHT.P$1 45.47,11.72 46.15,12.41 55.89,12.41 69.64,26.16 69.64,27.33 71.71,29.4 IC1.13
BTN_SEL  (via drill 0.25)
  Top 0.152: BTN_SEL.P$1 51.82,7.87 v54.36,10.41
  Bottom 0.152: IC1.14 71.56,28.13 69.95,26.51 69.95,26 v54.36,10.41
BTN_UP
  Bottom 0.152: BTN_UP.P$1 45.68,13.21 46.15,12.74 55.74,12.74 69.33,26.33 69.33,28.29 71.73,30.69 72.91,30.69 IC1.12
EINK_BUSY  (via drill 0.25)
  Top 0.152: v21.03,84.84 21.34,84.84 v37.85,68.33 | v37.77,58.54 37.77,57.99 39.37,56.39 39.37,26.67 v36.83,24.13
  Bottom 0.152: U$2.9 19.9,85.96 v21.03,84.84 | v37.85,68.33 37.85,58.61 v37.77,58.54 | v36.83,24.13 EBSY.2
EINK_CS  (via drill 0.25)
  Top 0.152: v41.4,35.56 41.4,56.39 38.76,59.03 35.41,59.03 v35.31,58.93
  Bottom 0.152: U$2.12 16.39,84.46 14.99,83.06 14.99,80.26 18.42,76.83 18.42,75.82 v35.31,58.93 | ECS.1 42.42,34.29 41.4,35.31 v41.4,35.56
EINK_DC  (via drill 0.25)
  Top 0.152: v20.36,83.89 20.36,83.3 39.12,64.55 v39.12,63.25 | v38.43,58.54 38.43,58.34 40.39,56.39 v40.39,32.04
  Bottom 0.152: U$2.11 19.29,84.96 v20.36,83.89 | v39.12,63.25 39.12,59.22 v38.43,58.54 | v40.39,32.04 40.68,31.75 EDC.1
EINK_RESET  (via drill 0.25)
  Top 0.152: v36.58,68.33 36.59,68.34 v20.33,84.6 | v37.11,58.51 37.11,26.95 v36.83,26.67
  Bottom 0.152: U$2.10 19.47,85.46 v20.33,84.6 | v36.58,68.33 36.58,59.05 v37.11,58.51 | v36.83,26.67 ERST.2
EN  (via drill 0.25)
  Top 0.152: v56.64,15.57 58.93,13.28 SW1.P$2
  Bottom 0.152: EN.P$1 MS1.27 49.64,19.05 49.73,19.14 50.85,19.14 50.94,19.05 MS1.27' 53.16,19.05 v56.64,15.57
FLASH_CS
  Bottom 0.152: FCS.P$1 55.88,56.33 53.22,56.33 IC3.1
GDR  (via drill 0.25)
  Top 0.254: v19.3,90.03 19.33,90.05 21.2,90.05 v33.02,78.23
  Bottom 0.254: v19.3,90.03 18.73,89.46 U$2.2 | Q1.1 33.09,78.17 v33.02,78.23
  Bottom 0.305: v19.3,90.03
GND  (via drill 0.25)
  other vias: 13.97,70.1 65.53,78.49 16.76,81.53 68.33,4.01 45.97,43.18 4.83,17.48 18.8,11.43 61.98,106.68
  pour Bottom: 80.77,112.52 0.51,112.52 -2.29,109.73 -2.29,1.27 0.76,-1.78 77.98,-1.78 80.77,1.02
  pour Top: 83.57,111.76 81.28,114.05 -0.25,114.05 -4.06,110.24 -4.06,-3.03 81.81,-3.03 83.57,-1.27
GPIO_INT
  Bottom 0.152: INT.2 38.19,32.85 55.84,32.85 56.82,31.88 IC1.8
MISO  (via drill 0.25)
  Top 0.152: v29.46,58.21 28.71,58.21 v27.93,57.43
  Bottom 0.152: IC3.2 51.69,56.77 51.05,57.4 27.95,57.4 v27.93,57.43 27.3,56.81 IC2.2 27.3,50.42 23.37,46.48 23.37,37.85 24.38,36.83 MS1.13' MS1.13 MISO.P$1 | v29.46,58.21 29.64,58.03 39.49,58.03 59.94,78.49 60.37,78.91 62.58,78.91 63.3,79.64 MICROSD.7
MOSI  (via drill 0.25)
  Top 0.152: v16,81.03 16.26,81.03 23.96,73.32 v23.96,62.14 48.3,62.14 v49.15,62.99
  Bottom 0.152: IC3.5 v49.15,62.99 49.15,65.66 58.42,74.93 58.71,75.22 58.73,75.24 MICROSD.3 | U$2.14 16.79,83.46 16,82.67 v16,81.03 | v23.96,62.14 24.77,61.34 IC2.5 24.77,60.58 22.61,58.42 22.61,36.07 24.38,34.29 MS1.12' MS1.12 MOSI.P$1
N$1
  Bottom 0.305: R8.2 12.32,15.12 C6.1 6.48,15.12 R9.2
N$2
  Bottom 0.254: D4.C 46.87,79.07 C9.2 | D5.A 49.02,78.41
  Bottom 0.305: 49.02,78.41 D4.C
N$3
  Bottom 0.254: 45.28,76.27 44.63,75.62 42.93,75.62 38.55,75.62 | Q1.3 36.95,77.22 L1.P$1
  Bottom 0.305: 45.28,76.27 C9.1 | D3.A 42.93,75.62 | L1.P$1 38.55,75.62
N$4
  Bottom 0.152: TP3.P$1 MS1.25 MS1.25'
N$5
  Bottom 0.152: MS1.24' MS1.24 TP2.P$1
N$6
  Bottom 0.152: TP1.P$1 MS1.23 MS1.23'
NC_D4
  Bottom 0.152: MS1.16' 26.78,44.45 26.87,44.54 27.99,44.54 28.08,44.45 MS1.16 XTRA.P$1
PREVGH  (via drill 0.25)
  Top 0.254: 37.82,80.54 v32,80.54
  Top 0.305: 37.82,80.54 v37.85,80.52
  Bottom 0.254: D3.C 39.95,82.04 | U$2.21 22.86,79.96 23.32,79.5 30.96,79.5 v32,80.54 | v37.85,80.52 38.03,80.52 C8.1
  Bottom 0.305: 39.95,82.04 C8.1
PREVGL  (via drill 0.25)
  Top 0.254: v41.87,83.02 v34.04,75.18
  Bottom 0.254: D4.A 47.15,77.24 45.1,77.24 44.92,77.42 44.92,79.98 v41.87,83.02 39.81,85.09 C7.1 | v34.04,75.18 29.46,75.18 28.19,76.45 24.89,76.45 22.38,78.96 U$2.23
RESE  (via drill 0.25)
  Top 0.254: v33.02,76.2 32.87,76.2 v19.83,89.24
  Bottom 0.254: 33.95,76.2 v33.02,76.2 | v19.83,89.24 19.55,88.96 U$2.3 | R5.1 37.63,74.42 35.86,74.42 Q1.2
  Bottom 0.305: Q1.2 33.95,76.2
RESET
  Bottom 0.152: RST.P$1 29.97,6.35 | 29.97,6.35 MS1.1 28.08,6.35 27.99,6.26 26.87,6.26 26.78,6.35 MS1.1' | BTN_RESET.P$1 30.1,6.22 29.97,6.35
RX  (via drill 0.25)
  Top 0.152: JP1.3 6.35,97.32 11.78,91.9 11.78,68.49 18.82,61.44 v18.82,57.35 | v27.43,39.37 26.9,39.37 v19.95,46.32
  Bottom 0.152: RX.P$1 MS1.14 v27.43,39.37 MS1.14' | v19.95,46.32 19.95,56.22 v18.82,57.35
SCK  (via drill 0.25)
  Top 0.152: v15.49,80.52 22.73,73.28 v22.73,61.59
  Bottom 0.152: U$2.13 16.65,83.96 15.49,82.8 v15.49,80.52 | 39.73,57.73 28.82,57.73 26.04,60.51 IC2.6 26.04,62.36 25.65,62.74 23.88,62.74 v22.73,61.59 21.84,60.71 21.84,34.29 24.38,31.75 MS1.11' MS1.11 SCK.P$1 | 39.73,57.73 48.07,57.73 50.42,60.07 IC3.6 | 39.73,57.73 59.44,77.44 MICROSD.5
SCL  (via drill 0.25)
  Top 0.152: v35.81,41.91 32.36,41.91 20.13,54.14 v19.31,54.14 v19.3,54.15 | v56.13,41.91 56.13,29.21 v57.15,28.19
  Bottom 0.152: v35.81,41.91 SCL.P$1 MS1.18 49.64,41.91 49.73,41.82 50.85,41.82 50.94,41.91 MS1.18' v56.13,41.91 R4.2 | v57.15,28.19 57.23,28.19 62.45,22.97 63.7,22.97 IC1.1 | I2C.4 v19.3,54.15
SD_CS
  Bottom 0.152: SDCS.1 43.18,40.06 43.52,40.4 60.21,40.4 73.15,53.34 73.15,73.67 72.69,74.14 MICROSD.2
SDA  (via drill 0.25)
  Top 0.152: v35.81,44.45 30.99,44.45 20.3,55.14 19.23,55.14 v19.22,55.13 | v55.63,44.45 v55.63,30.99
  Bottom 0.152: R3.2 v55.63,44.45 MS1.17' 50.94,44.45 50.85,44.54 49.73,44.54 49.64,44.45 MS1.17 SDA.P$1 v35.81,44.45 | v19.22,55.13 13.86,55.13 12.84,56.15 I2C.3 | IC1.2 62.36,24.26 v55.63,30.99
SRAM_CS
  Bottom 0.152: IC2.1 28.58,51.94 35.31,45.21 35.31,40.13 38.61,36.83 SRCS.1
TX  (via drill 0.25)
  Top 0.152: v20.57,49.53 20.57,48.01 26.94,41.65 v27.43,41.65 | JP1.1 12.08,108.32 12.08,68.69 19.16,61.62 19.16,58.06 v19.3,57.91
  Bottom 0.152: TX.P$1 MS1.15 29.76,41.82 27.86,41.82 27.69,41.65 v27.43,41.65 27.19,41.65 27.01,41.82 25.11,41.82 MS1.15' | v19.3,57.91 20.57,56.64 v20.57,49.53
VBAT
  Bottom 0.61: MS1.28' 51.27,16.51 50.95,16.19 49.63,16.19 49.32,16.51 MS1.28 BAT.P$1
VBUS
  Bottom 0.61: MS1.26' MS1.26 USB.P$1
VCOM
  Bottom 0.254: U$2.24 22.19,78.46 25.47,75.18 C16.2
VDD
  Bottom 0.254: C13.2 22.86,81.46 U$2.18
VGH
  Bottom 0.254: U$2.5 23.26,87.96 C11.2
VGL
  Bottom 0.254: U$2.4 19.84,88.46 24.85,93.47 C10.2
VSH
  Bottom 0.254: C14.2 23.69,81.28 22.87,80.46 U$2.20
VSL
  Bottom 0.254: C15.2 23.88,78.23 22.64,79.46 U$2.22

### Text on the board
tPlace: RX | GND | TX | 3V | Project info: | ``Da anni frequento questa biblioteca / e la esploro volume per volume, scaffale / per scaffale, ma potrei dimostrarvi che / non ho fatto altro che portare avanti / la lettura d'un unico libro.'' / - Italo Calvino, `Se una notte d'inverno un viaggiatore' | E-BOOK FEATHER WING | BTN_UP | BTN_LEFT | BTN_RIGHT | BTN_PREV | BTN_SEL | BTN_NEXT | by / joey castillo | Rev B | BTN_DOWN
bPlace: SERIAL / PORT | These are the Feather's UART pins, plus a 3V pin if / you need to power something like a GPS. Toss some / right angle header on here, it might prove useful. | RX | GND | TX | 3V | BTN_LOCK | E-PAPER DISPLAY | MICROSD SLOT | 20 Positive Source driving voltage / 21 Power Supply pin for VGH and VSH / 22 Negative Source driving voltage / 23 Power Supply for VCOM, VGL & VSL / 24 VCOM driving voltage | >1 NC / 2 N-Channel MOSFET Gate Drive Control / 3 Current Sense Input for Control Loop / 4 Negative Gate driving voltage / 5 Positive Gate driving voltage / 6 Clock for external LM75 temp sensor / 7 Data for external LM75 temp sensor / 8 Bus selection pin (tied to GND) / 9 Busy state output pin (EBSY) / 10 Reset (ERST) / 11 Data / Command input pin (EDC) / 12 Chip Select input pin (ECS) / 13 Serial clock pin (SPI: SCK) / 14 Serial data pin (SPI: MOSI) / 15 Power for interface logic pins / 16 Power Supply for chip / 17 Ground / 18 Core logic power pin / 19 Power Supply for / OTP Programming (NC) | A microSD card / interfaces with the / Feather mainboard / via the SPI interface / (MISO, MOSI, SCK, SDCS). / / C2 is a filtering cap / for the SD card's power / supply. | NC | `Previous Page' button / (if you want it) -> | This bit is / unrelated, just / an extra spot for / <- a `Next Page' / button. | FFC connector: 24 pos / 0.5mm pitch R/A with / contacts on TOP. | The e-paper panel has an / on-board booster that / generates the high(er) / voltages needed to drive the display. The circuit / on the left deals with the boost voltages. C10-C16 / are filtering caps for the power pins (in and out). | GND | 3V | A2 | 32KB SRAM CHIP | 2MB FLASH CHIP | The 23K256-I/SN SRAM / chip provides a buffer / for the display. It uses / the SPI interface + SRCS. / / A B&W 400x300 display / requires 15000 bytes; if / you have that RAM to / spare, omit this chip (and C4). | If you're using a non-Express / board that lacks onboard Flash, / an optional GD25Q16CTIGR Flash / chip can hold the entire GNU / Unifont in its 2MB of memory. It / uses the SPI interface, but / you'll need to wire the FCS / pad to a spare GPIO. If you / skip this chip, omit filtering capacitor C5. | GND | 3V | SDA | SCL | GPIO EXPANDER | The MCP23008 provides eight / additional GPIO pins via the / I2C interface. It connects to / all buttons except for RESET. / R3 and R4 are the / pull-up resistors for, / respectively, SDA and / SCL. This chip is / required to use the buttons, / unless you just want a few / wired directly to GPIO pads. / / Capacitor C3 filters power. | GND | 3V | A1 | The center port provides an I2C interface. The other / two ports provide access to pins A1 and A2. D1 & D2 / + R1 & R2 provide protection and current limiting. | EXTRA PORTS (JST-PH) | HEADPHONE JACK | The DAC on A0 drives mono / headphone jack J1. FB1 & FB2 / are ferrite beads that isolate / this analog circuit from the rest / of the board. R6 & R7 act as a / voltage divider on the isolated / 3V to set the bias of the output / signal. C6 acts as a coupling / capacitor; it lets the AC / component of the output signal / pass to the headphone jack, / while blocking the DC component. | BTN_LEFT | BTN_DOWN | BTN_UP | BTN_RIGHT | Bits: / 0: LEFT / 1: DOWN / 2: UP / 3: RIGHT / 4: SEL / 5: PREV / 6: NEXT / 7: LOCK | BTN_SEL | BTN_PREV | BTN_NEXT | BTN_LOCK | E-BOOK / FEATHER WING | by joey castillo | RESET | ENABLE_SWITCH | CC-BY-SA 4.0
tStop: github.com/joeycastillo/The-Open-Book | @josecastillo